# EAGLE design 5Vboostproto (EAGLE 5.07)
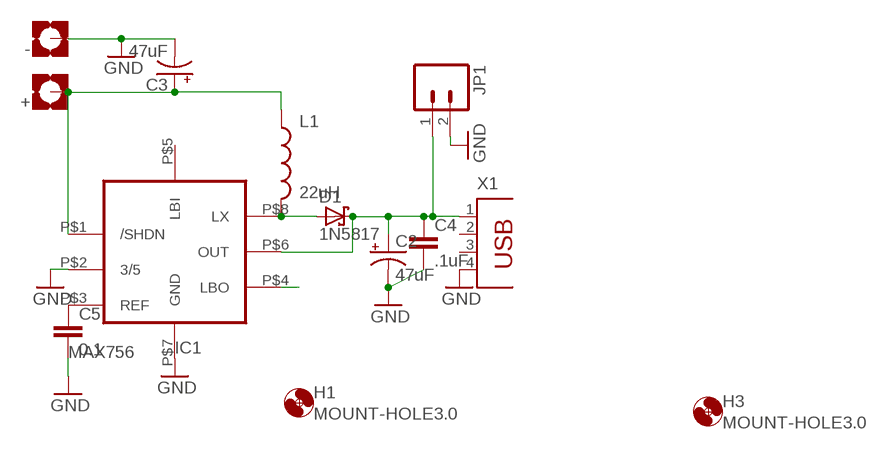
[diagram p0: schematic, sheet 1]

## Parts
+  MOUNT-PAD-SQUARE2.8  [2,8-PAD-SQUARE]
-  MOUNT-PAD-SQUARE2.8  [2,8-PAD-SQUARE]
C2  47uF  CAP_POL-CT6032  [CT6032]
C3  47uF  CAP_POL-CT6032  [CT6032]
C4  .1uF  CAP-C0805  [C0805]
C5  0.1  CAP-C0805  [C0805]
D1  1N5817  1N581-SMA  [SMA-DIODE]
H1  MOUNT-HOLE3.0  [3,0]
H3  MOUNT-HOLE3.0  [3,0]
IC1  MAX756  MAX756RF  [DIP8-RF]
JP1  CON-02-XH  [XH-1X2-LONG-LOCK]
L1  22uH  INDUCTOR-0.3-SMD  [AXIAL-0.3-SMD]
X1  PN87520  [PN87520]

## Nets
GND: -.B2,8(MOUNT) C2.- C3.- C4.2 C5.2 IC1.P$2(3/5) IC1.P$7(GND) JP1.2 X1.4
N$1: C5.1 IC1.P$3(REF)
N$2: +.B2,8(MOUNT) C3.+ IC1.P$1(/SHDN) L1.P$1
N$3: C2.+ C4.1 D1.C IC1.P$6(OUT) JP1.1 X1.1
N$5: D1.A IC1.P$8(LX) L1.P$2
N$6: IC1.P$4(LBO)
Unconnected: IC1.P$5(LBI) X1.2 X1.3

## Library data of the parts
+ - = holes:MOUNT-PAD-SQUARE: MOUNTING PAD, square
C2 C3 = digital-toy:CAP_POL: Capacitor Polarized These are standard SMD and PTH capacitors. Normally 10uF, 47uF, and 100uF in electrolytic and tantalum varieties. Always verify the external diameter of the through hole cap, it varies with capacity, voltage, and manufacturer. The EIA devices should be standard. PANASONIC_D size: 6.5mmx6.5mmx5.5mm, 100uf (taobao:6.3mmx5.5mm), same as CVL0605 153cvl0405 size: 4mmx4mmx5.5mm, 10uf (taobao:4mmx5.5mm) ct6032 typical 47uF Tantalum, comment by hyl.
C4 C5 = digital-toy:CAP: Capacitor Standard 0603 ceramic capacitor, and 0.1" leaded capacitor.
D1 = digital-toy:1N581*: 1.0A SCHOTTKY BARRIER RECTIFIER Source: http://www.diodes.com/datasheets/ds23001.pdf
H1 H3 = holes:MOUNT-HOLE: MOUNTING HOLE with drill center marker
IC1 = digital-toy:MAX756
JP1 = digital-toy:CON-02: Header 2 Standard 2-pin 0.1" header. Use with straight break away headers (SKU : PRT-00116), right angle break away headers (PRT-00553), swiss pins (PRT-00743), machine pins (PRT-00117), and female headers (PRT-00115). Molex polarized connector foot print use with SKU : PRT-08233 with associated crimp pins and housings.
L1 = digital-toy:INDUCTOR: Inductors Basic Inductor/Choke - 0603 and 1206. Footprints are not proven and vary greatly between part numbers.
X1 = con-berg:PN87520: BERG USB connector

## Board
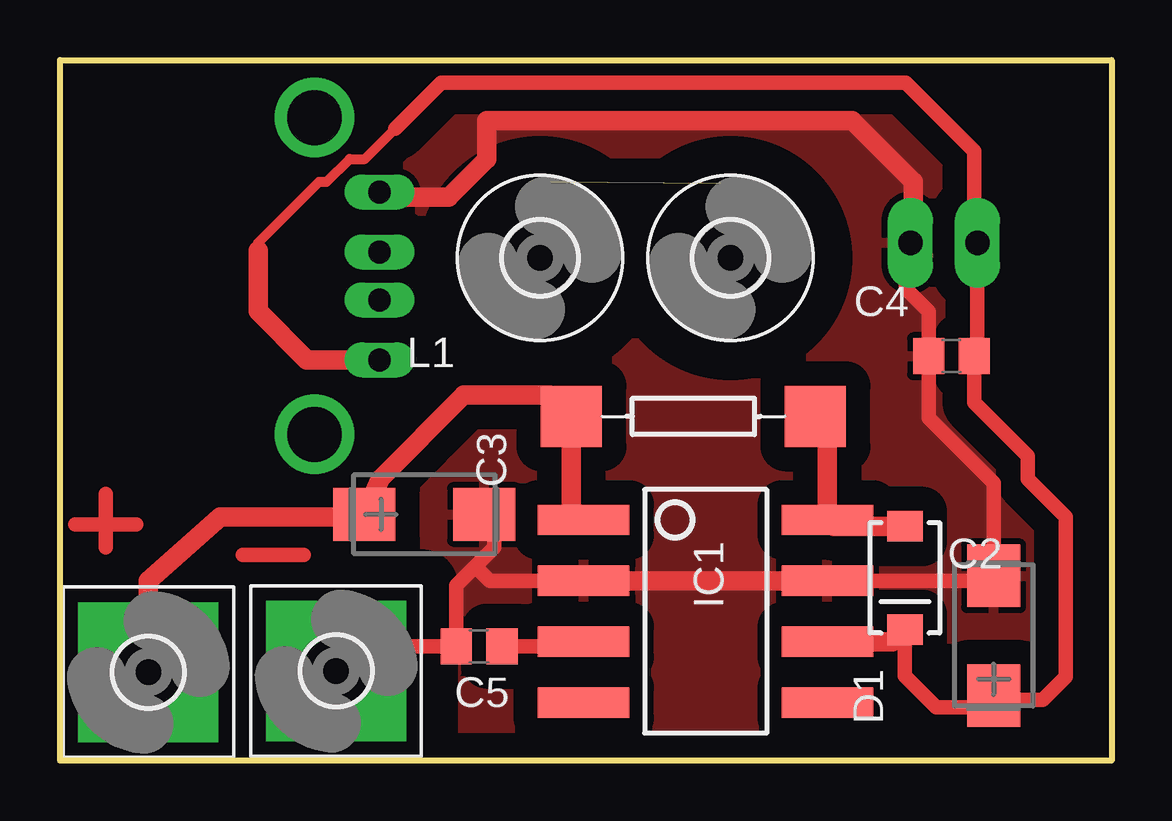
[diagram p1: board, top side]
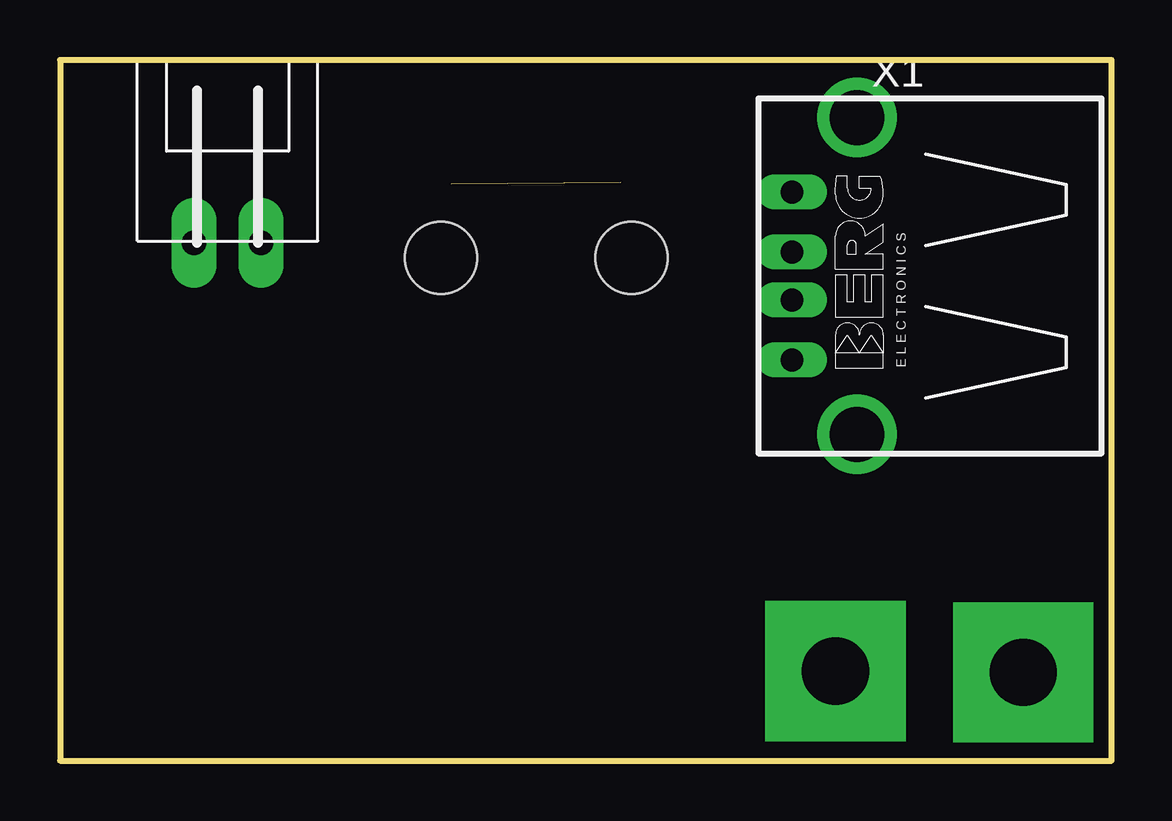
[diagram p2: board, bottom side, seen from below]

Size 43.81 x 29.21 mm. Coordinates in mm from the lower left corner, seen from the top.
Outline: 27.52,24.06 20.46,24.11
Outline: 0,29.21 43.81,29.21 43.81,0 0,0 0,29.21
Copper layers (1*16): Top 0.035mm / dielectric 1.5mm / Bottom 0.035mm
Design rules "default": minimum track width 10mil, minimum drill 24mil, track to track 16mil, track to pad 16mil, pad to pad 16mil, via to via 16mil, smd to smd 8mil, copper to edge 10mil, drill to drill 8mil, minimum pad ring 10mil, minimum via ring 8mil, stop-mask expansion 4mil, vias tented up to drill 0mil, thermal gap 10mil

### Footprints (pad centres in the part's own frame; a part is rotated, then mirrored left to right if it is on the bottom)
2,8-PAD-SQUARE = drill 2.8 pad 5.842 square: B2,8 0,0
CT6032 = smd 2.6 x 2.2: + -2.5,0; - 2.5,0
C0805 = smd 1.3 x 1.5: 1 -0.95,0; 2 0.95,0
SMA-DIODE = smd 1.27 x 1.47: A -2.15,0; C 2.15,0
3,0 = hole 3: 0,0
DIP8-RF = smd 1.27 x 3.81: P$1 0,-3.81; P$2 2.54,-3.81; P$3 5.08,-3.81; P$4 7.62,-3.81; P$5 7.62,6.35; P$6 5.08,6.35; P$7 2.54,6.35; P$8 0,6.35
XH-1X2-LONG-LOCK = drill 1.016 pad 1.88 long: 1 -1.397,0; 2 1.397,0
AXIAL-0.3-SMD = smd 2.54 x 2.54: P$1 -5.08,0; P$2 5.08,0
PN87520 = drill 0.95 long: 1 -3.5,2.71; 2 -1,2.71; 3 1,2.71; 4 3.5,2.71 | drill 2.286 round: P$1 -6.604,0; P$2 6.604,0

### Placement (x,y rotation side)
+  3.68,3.68 0 top
-  11.51,3.73 0 top
C2  38.9,5.21 90 top
C3  15.18,10.26 0 top
C4  37.15,16.87 180 top
C5  17.46,4.76 180 top
D1  35.2,7.62 270 top
H1  27.94,20.95 0 top
H3  20,20.95 0 top
IC1  25.63,10.03 270 top
JP1  36.83,21.59 0 bottom
L1  26.39,14.35 0 top
X1  10.6,20.21 90 bottom

### Tracks (layer width: path | path; a pad name or v marks a point on that pad's centre or on a via)
GND
  Top 0.406: C5.2
  Top 0.61: -.B2,8 12.94,3.73 13.97,4.76 C5.2 16.51,7.3 17.3,8.1 | 17.3,8.1 18.1,8.89 18.1,10.05 C3.- | IC1.P$2 17.91,7.49 17.3,8.1 | IC1.P$7 38.69,7.49 C2.- 38.9,11.58 36.2,14.29 C4.2 36.2,18.73 35.24,19.68 35.24,21.4 JP1.2
  Top 0.813: 22.61,7.37 22.86,7.62 21.95,7.62 IC1.P$2 IC1.P$7 | 35.97,21.06 JP1.2 35.56,21.72 35.56,24.13 33.02,26.67 17.78,26.67 17.78,25.08 16.19,23.5 13.53,23.5 X1.4
  pour Top (isolate 1.016): 13.65,37.47 41.59,38.42 66.04,-12.06 48.26,-10.79 48.58,-11.11 15.56,-12.06 10.79,-1.91 13.97,-2.86
N$1
  Top 0.61: C5.1 21.63,4.76 IC1.P$3
N$2
  Top 0.813: +.B2,8 3.68,7.49 6.67,10.16 13.44,10.16 C3.+ 13.34,11.75 16.83,15.24 20.42,15.24 L1.P$1 21.31,10.54 IC1.P$1
N$3
  Top 0.406: 8.26,21.27 8.26,21.59 10.79,24.13 11.11,24.13 12.06,25.08 12.7,25.08 13.97,26.35
  Top 0.61: 38.1,21.72 38.1,25.4 35.24,28.26 15.88,28.26 13.97,26.35 | D1.C 35.2,3.53 36.51,2.22 38.42,2.22 C2.+ 39.07,2.54 40.96,2.54 41.91,3.49 41.91,10.16 40.32,11.75 40.32,12.7 38.1,14.93 C4.1 38.23,17 JP1.1
  Top 0.813: IC1.P$6 34.69,4.95 D1.C | 38.1,21.72 JP1.1 | X1.1 10.28,16.71 8.26,18.73 8.26,21.27
N$4
  Top 0.61: 1.91,8.89 1.91,11.11
N$5
  Top 0.813: D1.A 32.24,9.77 IC1.P$8 31.98,13.84 L1.P$2
N$8
  Top 0.305: 2.52,9.91 0.86,9.91
N$9
  Top 0.61: 0.64,9.84 3.17,9.84
N$10
  Top 0.61: 7.62,8.57 10.16,8.57